# EAGLE design relayboard (EAGLE 8.1.1)
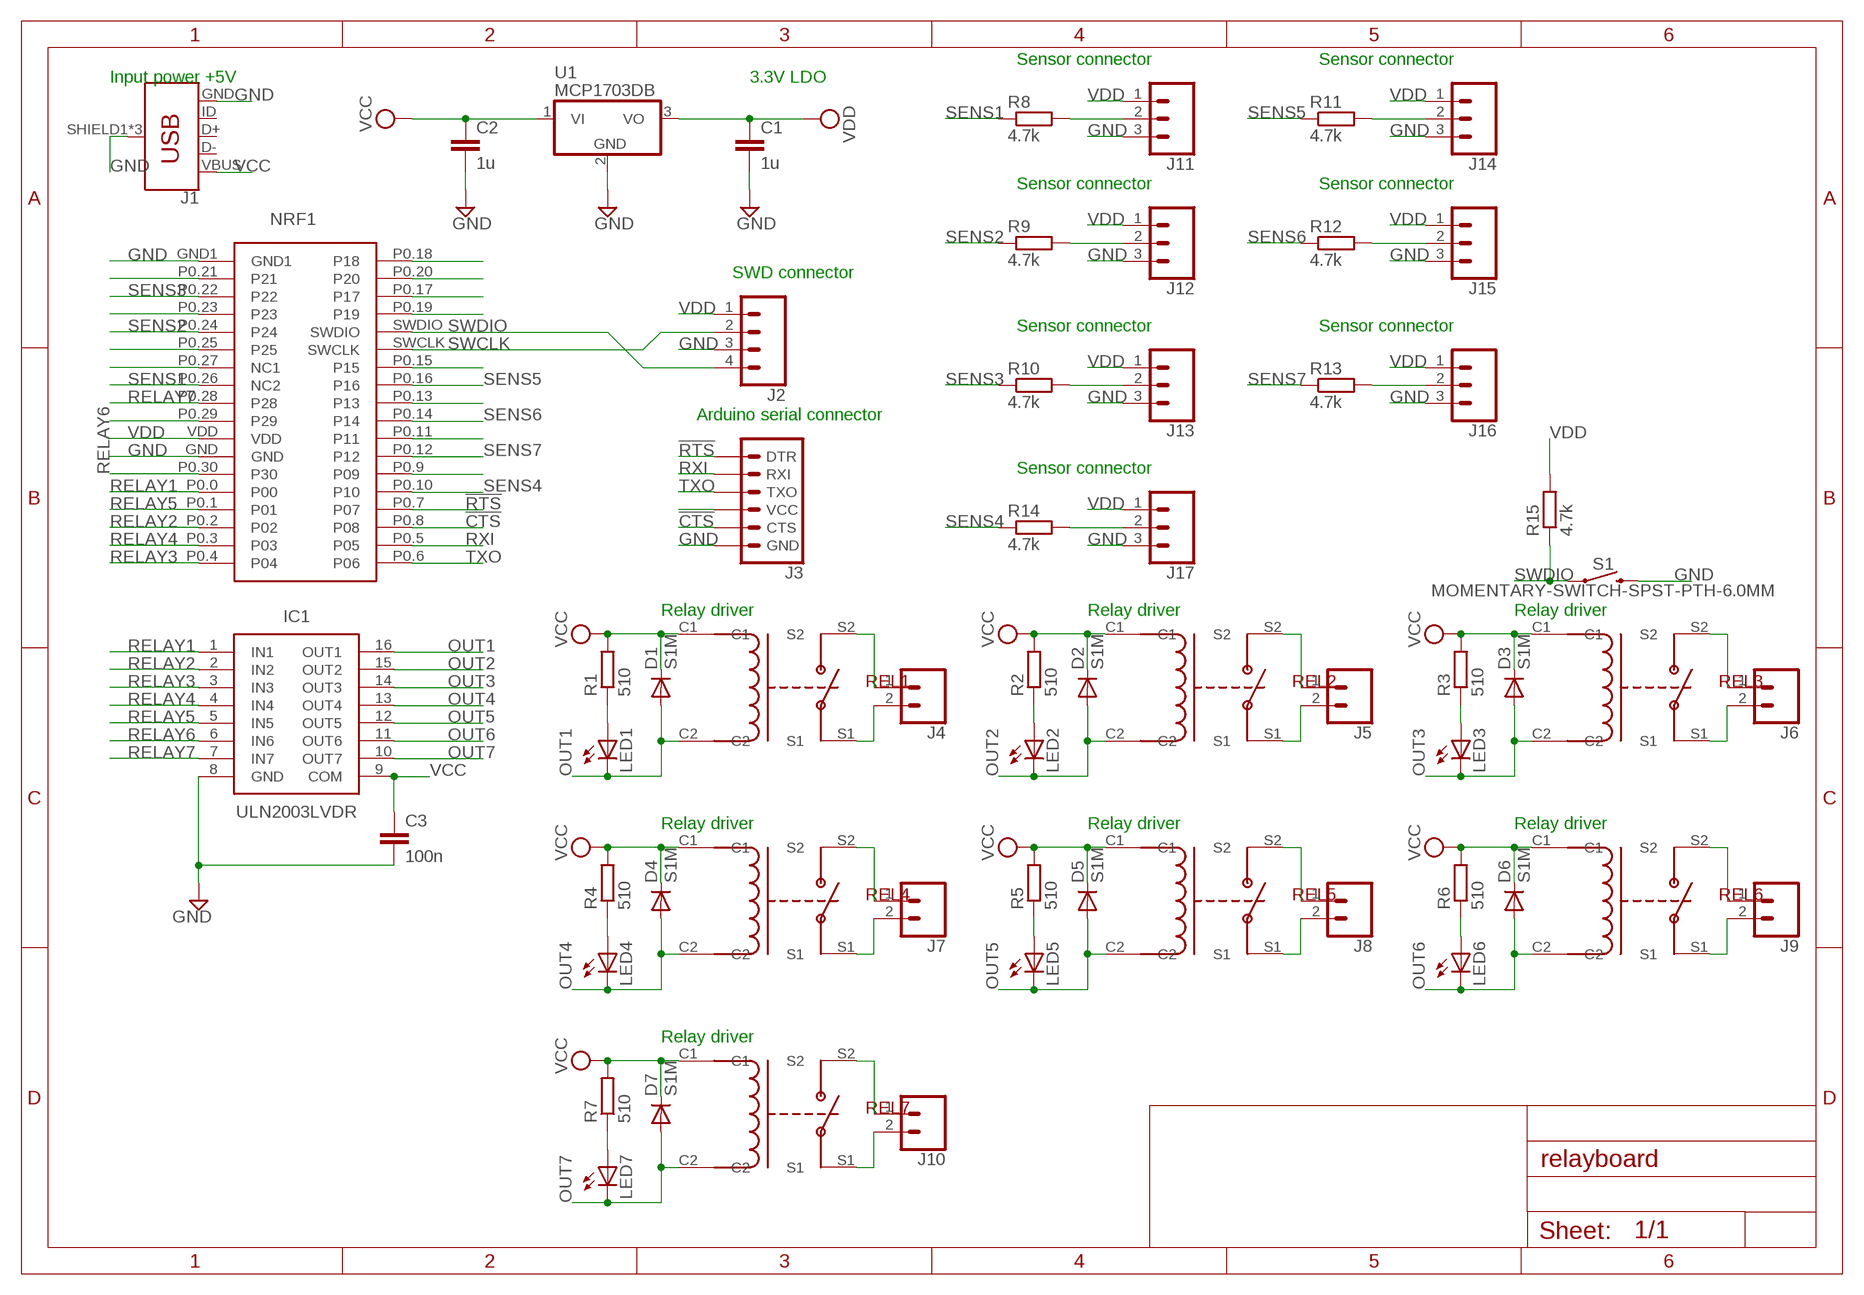
[diagram p0: schematic, sheet 1]

## Parts
C1  1u  C-EUC0805  [C0805]
C2  1u  C-EUC0805  [C0805]
C3  100n  C-EUC0805  [C0805]
D1  S1M  [SMA]
D2  S1M  [SMA]
D3  S1M  [SMA]
D4  S1M  [SMA]
D5  S1M  [SMA]
D6  S1M  [SMA]
D7  S1M  [SMA]
IC1  ULN2003LVDR  [SOIC127P600X175-16N]
J1  USB_MICRO-B_FEMALE-SMT  [USB-B-MICRO-SMD]
J2  CONN_04  [1X04]
J3  6_PIN_SERIAL_TARGET  [1X06]
J4  CONN_025MM  [SCREWTERMINAL-5MM-2]
J5  CONN_025MM  [SCREWTERMINAL-5MM-2]
J6  CONN_025MM  [SCREWTERMINAL-5MM-2]
J7  CONN_025MM  [SCREWTERMINAL-5MM-2]
J8  CONN_025MM  [SCREWTERMINAL-5MM-2]
J9  CONN_025MM  [SCREWTERMINAL-5MM-2]
J10  CONN_025MM  [SCREWTERMINAL-5MM-2]
J11  CONN_03SCREW  [SCREWTERMINAL-3.5MM-3]
J12  CONN_03SCREW  [SCREWTERMINAL-3.5MM-3]
J13  CONN_03SCREW  [SCREWTERMINAL-3.5MM-3]
J14  CONN_03SCREW  [SCREWTERMINAL-3.5MM-3]
J15  CONN_03SCREW  [SCREWTERMINAL-3.5MM-3]
J16  CONN_03SCREW  [SCREWTERMINAL-3.5MM-3]
J17  CONN_03SCREW  [SCREWTERMINAL-3.5MM-3]
LED1  LEDSML1206  [SML1206]
LED2  LEDSML1206  [SML1206]
LED3  LEDSML1206  [SML1206]
LED4  LEDSML1206  [SML1206]
LED5  LEDSML1206  [SML1206]
LED6  LEDSML1206  [SML1206]
LED7  LEDSML1206  [SML1206]
NRF1  NRF51822MODULE  [NRF]
R1  510  R-EU_R0603  [R0603]
R2  510  R-EU_R0603  [R0603]
R3  510  R-EU_R0603  [R0603]
R4  510  R-EU_R0603  [R0603]
R5  510  R-EU_R0603  [R0603]
R6  510  R-EU_R0603  [R0603]
R7  510  R-EU_R0603  [R0603]
R8  4.7k  R-EU_R0603  [R0603]
R9  4.7k  R-EU_R0603  [R0603]
R10  4.7k  R-EU_R0603  [R0603]
R11  4.7k  R-EU_R0603  [R0603]
R12  4.7k  R-EU_R0603  [R0603]
R13  4.7k  R-EU_R0603  [R0603]
R14  4.7k  R-EU_R0603  [R0603]
R15  4.7k  R-EU_R0603  [R0603]
REL1  NY5WK  [NY5WK]
REL2  NY5WK  [NY5WK]
REL3  NY5WK  [NY5WK]
REL4  NY5WK  [NY5WK]
REL5  NY5WK  [NY5WK]
REL6  NY5WK  [NY5WK]
REL7  NY5WK  [NY5WK]
S1  MOMENTARY-SWITCH-SPST-PTH-6.0MM  [TACTILE_SWITCH_PTH_6.0MM]
U1  MCP1703DB  [SOT223]

## Nets
!CTS: J3.5(CTS) NRF1.P0.8(P08)
!RTS: J3.1(DTR) NRF1.P0.7(P07)
GND [dc_power]: C1.2 C2.2 C3.2 IC1.8(GND) J1.GND J1.SHIELD1(SHIELD) J1.SHIELD2(SHIELD) J1.SHIELD3(SHIELD) J2.3 J3.6(GND) J11.3 J12.3 J13.3 J14.3 J15.3 J16.3 J17.3 NRF1.GND NRF1.GND1 S1.3 U1.2(GND)
N$1: LED1.A R1.1
N$2 [ac_power]: J4.1 REL1.S2
N$3: NRF1.P0.21(P21)
N$4: NRF1.P0.9(P09)
N$5: NRF1.P0.23(P23)
N$6: NRF1.P0.18(P18)
N$7: NRF1.P0.25(P25)
N$8: NRF1.P0.27(NC1)
N$9: NRF1.P0.20(P20)
N$10: NRF1.P0.17(P17)
N$11: NRF1.P0.29(P29)
N$12: NRF1.P0.19(P19)
N$13: NRF1.P0.11(P11)
N$14: NRF1.P0.13(P13)
N$18: J12.2 R9.2
N$29: NRF1.P0.15(P15)
N$30 [ac_power]: J4.2 REL1.S1
N$31: LED2.A R2.1
N$36: J3.4(VCC)
N$37 [ac_power]: J5.1 REL2.S2
N$38 [ac_power]: J5.2 REL2.S1
N$39: LED3.A R3.1
N$40 [ac_power]: J6.1 REL3.S2
N$41 [ac_power]: J6.2 REL3.S1
N$42: LED4.A R4.1
N$43 [ac_power]: J7.1 REL4.S2
N$44 [ac_power]: J7.2 REL4.S1
N$45: LED5.A R5.1
N$46 [ac_power]: J8.1 REL5.S2
N$47 [ac_power]: J8.2 REL5.S1
N$48: LED6.A R6.1
N$49 [ac_power]: J9.1 REL6.S2
N$50 [ac_power]: J9.2 REL6.S1
N$51: LED7.A R7.1
N$52 [ac_power]: J10.1 REL7.S2
N$53 [ac_power]: J10.2 REL7.S1
N$54: J11.2 R8.2
N$55: J13.2 R10.2
N$56: J14.2 R11.2
N$57: J15.2 R12.2
N$58: J16.2 R13.2
N$59: J17.2 R14.2
OUT1 [dc_power]: D1.A IC1.16(OUT1) LED1.C REL1.C2
OUT2 [dc_power]: D2.A IC1.15(OUT2) LED2.C REL2.C2
OUT3 [dc_power]: D3.A IC1.14(OUT3) LED3.C REL3.C2
OUT4 [dc_power]: D4.A IC1.13(OUT4) LED4.C REL4.C2
OUT5 [dc_power]: D5.A IC1.12(OUT5) LED5.C REL5.C2
OUT6 [dc_power]: D6.A IC1.11(OUT6) LED6.C REL6.C2
OUT7 [dc_power]: D7.A IC1.10(OUT7) LED7.C REL7.C2
RELAY1: IC1.1(IN1) NRF1.P0.0(P00)
RELAY2: IC1.2(IN2) NRF1.P0.2(P02)
RELAY3: IC1.3(IN3) NRF1.P0.4(P04)
RELAY4: IC1.4(IN4) NRF1.P0.3(P03)
RELAY5: IC1.5(IN5) NRF1.P0.1(P01)
RELAY6: IC1.6(IN6) NRF1.P0.30(P30)
RELAY7: IC1.7(IN7) NRF1.P0.28(P28)
RXI: J3.2(RXI) NRF1.P0.5(P05)
SENS1: NRF1.P0.26(NC2) R8.1
SENS2: NRF1.P0.24(P24) R9.1
SENS3: NRF1.P0.22(P22) R10.1
SENS4: NRF1.P0.10(P10) R14.1
SENS5: NRF1.P0.16(P16) R11.1
SENS6: NRF1.P0.14(P14) R12.1
SENS7: NRF1.P0.12(P12) R13.1
SWCLK: J2.2 NRF1.SWCLK
SWDIO: J2.4 NRF1.SWDIO R15.1 S1.1
TXO: J3.3(TXO) NRF1.P0.6(P06)
VCC [dc_power]: C2.1 C3.1 D1.C D2.C D3.C D4.C D5.C D6.C D7.C IC1.9(COM) J1.VBUS R1.2 R2.2 R3.2 R4.2 R5.2 R6.2 R7.2 REL1.C1 REL2.C1 REL3.C1 REL4.C1 REL5.C1 REL6.C1 REL7.C1 U1.1(VI)
VDD: C1.1 J2.1 J11.1 J12.1 J13.1 J14.1 J15.1 J16.1 J17.1 NRF1.VDD R15.2 U1.3(VO)
Unconnected: J1.D+ J1.D- J1.ID

## Notes on the sheet
- Sensor connector | Sensor connector
- Input power +5V | 3.3V LDO
- Sensor connector | Sensor connector
- SWD connector
- Sensor connector | Sensor connector
- Arduino serial connector
- Sensor connector
- Relay driver | Relay driver | Relay driver
- Relay driver | Relay driver | Relay driver
- Relay driver

## Library data of the parts
C1-C3 = rcl:C-EU: CAPACITOR, European symbol
D1-D7 = diode:S1M
IC1 = ULN2003LVDR:ULN2003LVDR: 7-Ch Relay, Inductive Sink Driver SOIC16 Texas Instruments ULN2003LVDR, 7-element NPN Darlington Transistor Array, 140 mA 8 V, 16-Pin SOIC <https://componentsearchengine.com/Images/3/ULN2003LVDR.jpg> Source: Datasheet <http://www.ti.com/lit/ds/symlink/uln2003lv.pdf>; DESCRIPTION: 7-Ch Relay, Inductive Sink Driver SOIC16 Texas Instruments ULN2003LVDR, 7-element NPN Darlington Transistor Array, 140 mA 8 V, 16-Pin SOIC; HEIGHT: 1.75mm; MANUFACTURER_NAME: Texas Instruments; MANUFACTURER_PART_NUMBER: ULN2003LVDR; RS_PART_NUMBER: 8095475; SUPPLIER_NAME: RS
J1 = newrelay:USB_MICRO-B: USB Type Micro-B Connector Male/female and PTH/SMT variants SparkFun Products: SparkFun microB USB Breakout <https://www.sparkfun.com/products/12035> SparkFun USB microB Plug Breakout <https://www.sparkfun.com/products/10031> SparkFun ESP8266 Thing <https://www.sparkfun.com/products/13231>; PROD_ID: CONN-11752
J2 = SparkFun-Connectors:CONN_04: Multi connection point. Often used as Generic Header-pin footprint for 0.1 inch spaced/style header connections On any of the 0.1 inch spaced packages, you can populate with these: Break Away Headers - Straight <https://www.sparkfun.com/products/116> (PRT-00116) Break Away Male Headers - Right Angle <https://www.sparkfun.com/products/553> (PRT-00553) Female Headers <https://www.sparkfun.com/products/115> (PRT-00115) Break Away Headers - Machine Pin <https://www.sparkfun.com/products/117> (PRT-00117) Break Away Female Headers - Swiss Machine Pin <https://www.sparkfun.com/products/743> (PRT-00743) For SCREWTERMINALS and SPRING TERMINALS visit here: Screw Terimnals on SparkFun.com <https://www.sparkfun.com/search/results?term=Screw+Terminals> (5mm/3.5mm/2.54mm spacing) This device is also useful as a general connection point to wire up your design to another part of your project. Our various solder wires solder well into these plated through hole pads. Hook-Up Wire - Assortment (Stranded, 22 AWG) <https://www.sparkfun.com/products/11375> (PRT-11375) Hook-Up Wire - Assortment (Solid Core, 22 AWG) <https://www.sparkfun.com/products/11367> (PRT-11367) View the entire wire category on our website here <https://www.sparkfun.com/categories/141> Special notes: Molex polarized connector foot print use with SKU : PRT-08231 with associated crimp pins and housings. 1MM SMD Version SKU: PRT-10208; PROD_ID: CONN-09696
J3 = SparkFun-Connectors:6_PIN_SERIAL_TARGET: 6-pin header connection for use with the "FTDI BASIC" pinout - TARGET SIDE. Also known as "Arduino Serial Program Header". It is used to mate with our FTDI Basic serial programmers using the Arduino IDE. Note, this device has "TARGET" in the name. It is intended to be used on a design that contains a target micro-controller that you wish to program. The "sister" device, named "CABLE" is inteneded to be used on a design that usually lives on the end of your USB cable and prvides the converter chip (FTDI232 or FTDI231x) to commnicate serial RX/TX. You can populate with some of these: Break Away Headers - Straight <https://www.sparkfun.com/products/116> (PRT-00116) For reference (or to suit your programming needs) check out these designs: SparkFun FTDI Basic Breakout - 5V <https://www.sparkfun.com/products/9716> (DEV-09716) SparkFun FTDI Basic Breakout - 3.3V <https://www.sparkfun.com/products/9873> (DEV-09873) SparkFun FTDI SmartBasic <https://www.sparkfun.com/products/12935> (DEV-12935) SparkFun Beefy 3 - FTDI Basic Breakout <https://www.sparkfun.com/products/13746> (DEV-13746)
J4-J10 = SparkFun-Connectors:CONN_02: Multi connection point. Often used as Generic Header-pin footprint for 0.1 inch spaced/style header connections On any of the 0.1 inch spaced packages, you can populate with these: Break Away Headers - Straight <https://www.sparkfun.com/products/116> (PRT-00116) Break Away Male Headers - Right Angle <https://www.sparkfun.com/products/553> (PRT-00553) Female Headers <https://www.sparkfun.com/products/115> (PRT-00115) Break Away Headers - Machine Pin <https://www.sparkfun.com/products/117> (PRT-00117) Break Away Female Headers - Swiss Machine Pin <https://www.sparkfun.com/products/743> (PRT-00743) For SCREWTERMINALS and SPRING TERMINALS visit here: Screw Terimnals on SparkFun.com <https://www.sparkfun.com/search/results?term=Screw+Terminals> (5mm/3.5mm/2.54mm spacing) This device is also useful as a general connection point to wire up your design to another part of your project. Our various solder wires solder well into these plated through hole pads. Hook-Up Wire - Assortment (Stranded, 22 AWG) <https://www.sparkfun.com/products/11375> (PRT-11375) Hook-Up Wire - Assortment (Solid Core, 22 AWG) <https://www.sparkfun.com/products/11367> (PRT-11367) View the entire wire category on our website here <https://www.sparkfun.com/categories/141> Special notes: Molex polarized connector foot print use with: PRT-08233 with associated crimp pins and housings. 2.54_SCREWTERM for use with PRT-10571. 3.5mm Screw Terminal footprints for PRT-08084 5mm Screw Terminal footprints for use with PRT-08432; SF_SKU: PRT-08432
J11-J17 = SparkFun-Connectors:CONN_03: Multi connection point. Often used as Generic Header-pin footprint for 0.1 inch spaced/style header connections On any of the 0.1 inch spaced packages, you can populate with these: Break Away Headers - Straight <https://www.sparkfun.com/products/116> (PRT-00116) Break Away Male Headers - Right Angle <https://www.sparkfun.com/products/553> (PRT-00553) Female Headers <https://www.sparkfun.com/products/115> (PRT-00115) Break Away Headers - Machine Pin <https://www.sparkfun.com/products/117> (PRT-00117) Break Away Female Headers - Swiss Machine Pin <https://www.sparkfun.com/products/743> (PRT-00743) Stackable Header - 3 Pin (Female, 0.1") <https://www.sparkfun.com/products/13875> (PRT-13875) For SCREWTERMINALS and SPRING TERMINALS visit here: Screw Terimnals on SparkFun.com <https://www.sparkfun.com/search/results?term=Screw+Terminals> (5mm/3.5mm/2.54mm spacing) This device is also useful as a general connection point to wire up your design to another part of your project. Our various solder wires solder well into these plated through hole pads. Hook-Up Wire - Assortment (Stranded, 22 AWG) <https://www.sparkfun.com/products/11375> (PRT-11375) Hook-Up Wire - Assortment (Solid Core, 22 AWG) <https://www.sparkfun.com/products/11367> (PRT-11367) View the entire wire category on our website here <https://www.sparkfun.com/categories/141> Special notes: Molex polarized connector foot print use with SKU : PRT-08232 with associated crimp pins and housings.; PROD_ID: CONN-08288; SF_ID: PRT-08235
LED1-LED7 = led:LED: LED OSRAM: - CHIPLED LG R971, LG N971, LY N971, LG Q971, LY Q971, LO R971, LY R971 LH N974, LH R974 LS Q976, LO Q976, LY Q976 LO Q996 - Hyper CHIPLED LW Q18S LB Q993, LB Q99A, LB R99A - SideLED LS A670, LO A670, LY A670, LG A670, LP A670 LB A673, LV A673, LT A673, LW A673 LH A674 LY A675 LS A676, LA A676, LO A676, LY A676, LW A676 LS A679, LY A679, LG A679 - Hyper Micro SIDELED® LS Y876, LA Y876, LO Y876, LY Y876 LT Y87S - SmartLED LW L88C, LW L88S LB L89C, LB L89S, LG L890 LS L89K, LO L89K, LY L89K LS L896, LA L896, LO L896, LY L896 - TOPLED LS T670, LO T670, LY T670, LG T670, LP T670 LSG T670, LSP T670, LSY T670, LOP T670, LYG T670 LG T671, LOG T671, LSG T671 LB T673, LV T673, LT T673, LW T673 LH T674 LS T676, LA T676, LO T676, LY T676, LB T676, LH T676, LSB T676, LW T676 LB T67C, LV T67C, LT T67C, LS T67K, LO T67K, LY T67K, LW E67C LS E67B, LA E67B, LO E67B, LY E67B, LB E67C, LV E67C, LT E67C LW T67C LS T679, LY T679, LG T679 LS T770, LO T770, LY T770, LG T770, LP T770 LB T773, LV T773, LT T773, LW T773 LH T774 LS E675, LA E675, LY E675, LS T675 LS T776, LA T776, LO T776, LY T776, LB T776 LHGB T686 LT T68C, LB T68C - Hyper Mini TOPLED® LB M676 - Mini TOPLED Santana® LG M470 LS M47K, LO M47K, LY M47K Source: http://www.osram.convergy.de LUXEON: - LUMILED® LXK2-PW12-R00, LXK2-PW12-S00, LXK2-PW14-U00, LXK2-PW14-V00 LXK2-PM12-R00, LXK2-PM12-S00, LXK2-PM14-U00 LXK2-PE12-Q00, LXK2-PE12-R00, LXK2-PE12-S00, LXK2-PE14-T00, LXK2-PE14-U00 LXK2-PB12-K00, LXK2-PB12-L00, LXK2-PB12-M00, LXK2-PB14-N00, LXK2-PB14-P00, LXK2-PB14-Q00 LXK2-PR12-L00, LXK2-PR12-M00, LXK2-PR14-Q00, LXK2-PR14-R00 LXK2-PD12-Q00, LXK2-PD12-R00, LXK2-PD12-S00 LXK2-PH12-R00, LXK2-PH12-S00 LXK2-PL12-P00, LXK2-PL12-Q00, LXK2-PL12-R00 Source: www.luxeon.com KINGBRIGHT: KA-3528ASYC Source: www.kingbright.com
NRF1 = nrf:NRF51822MODULE
R1-R15 = rcl:R-EU_: RESISTOR, European symbol
REL1-REL7 = ny5wk:NY5WK
S1 = SparkFun-Switches:MOMENTARY-SWITCH-SPST: Momentary Switch (Pushbutton) - SPST Normally-open (NO) SPST momentary switches (buttons, pushbuttons). Variants PTH-12MM - 12mm square, through-hole Momentary Pushbutton Switch - 12mm Square <https://www.sparkfun.com/products/9190> (COM-09190) PTH-6.0MM, PTH-6.0MM-KIT - 6.0mm square, through-hole Mini Pushbutton Switch <https://www.sparkfun.com/products/97> (COM-00097) KIT package intended for soldering kit's - only one side of pads' copper is exposed. PTH-RIGHT-ANGLE-KIT - Right-angle, through-hole Right Angle Tactile Button <https://www.sparkfun.com/products/10791> - Used on SparkFun BigTime Watch Kit <https://www.sparkfun.com/products/11734> SMD-12MM - 12mm square, surface-mount Tactile Button - SMD (12mm) <https://www.sparkfun.com/products/12993> (COM-12993) Used on SparkFun PicoBoard <https://www.sparkfun.com/products/11888> SMD-4.5MM - 4.5mm Square Trackball Switch Used on SparkFun Blackberry Trackballer Breakout <https://www.sparkfun.com/products/13169> SMD-4.6MMX2.8MM - 4.60mm x 2.80mm, surface mount Used on SparkFun SAMD21 Mini Breakout <https://www.sparkfun.com/products/13664> SMD-5.2MM, SMD-5.2-REDUNDANT - 5.2mm square, surface-mount Mini Pushbutton Switch - SMD <https://www.sparkfun.com/products/8720> (COM-08720) Used on Arduino Pro Mini <https://www.sparkfun.com/products/11114> REDUNDANT package connects both switch circuits together SMD-6.0X3.5MM - 6.0 x 3.5mm, surface mount Momentary Reset Switch SMD <https://www.sparkfun.com/products/8229> (COM-08229) SMD-6.2MM-TALL - 6.2mm square, surface mount Tactile Button - SMD (6mm) <https://www.sparkfun.com/products/12992> Used on SparkFun Digital Sandbox <https://www.sparkfun.com/products/12651> SMD-RIGHT-ANGLE - Right-angle, surface mount Used on SparkFun Block for Intel® Edison - Arduino <https://www.sparkfun.com/products/13036>; PROD_ID: SWCH-08441; SF_SKU: COM-00097
U1 = linear:MCP1703: 250 mA, 16V, Low Quiescent Current LDO Regulator Source: http://ww1.microchip.com/downloads/en/DeviceDoc/22049b.pdf

## Net classes
0 net: width 0.254 mm, drill 0.254 mm, clearance 0.254 mm
1 dc_power: width 0.508 mm, drill 0.508 mm, clearance 0.254 mm
2 ac_power: width 1.016 mm, drill 1.016 mm, clearance 0.508 mm

## Board
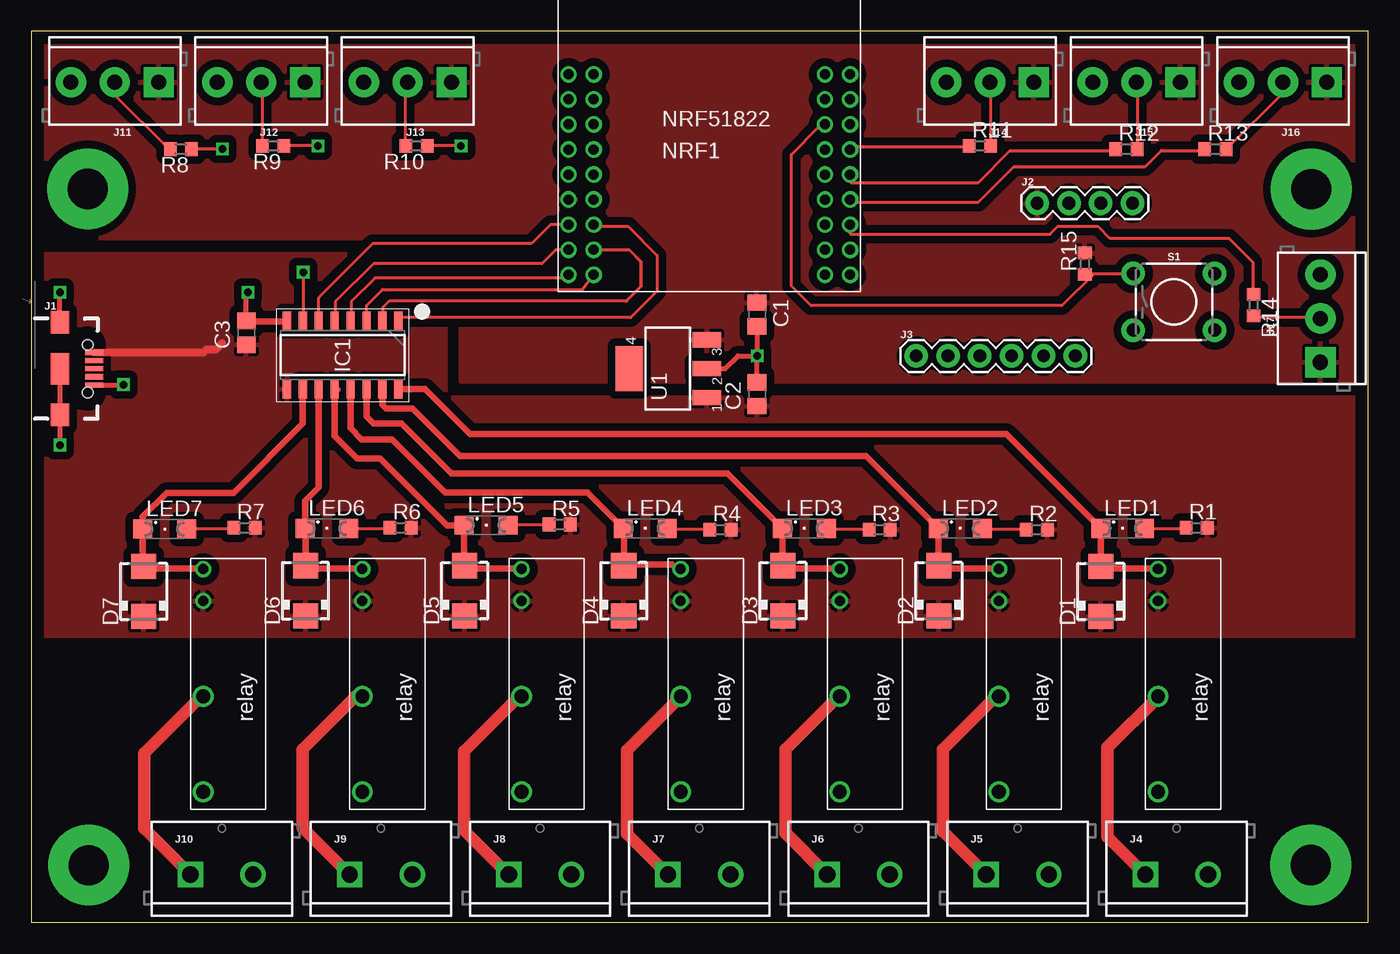
[diagram p1: board, top side]
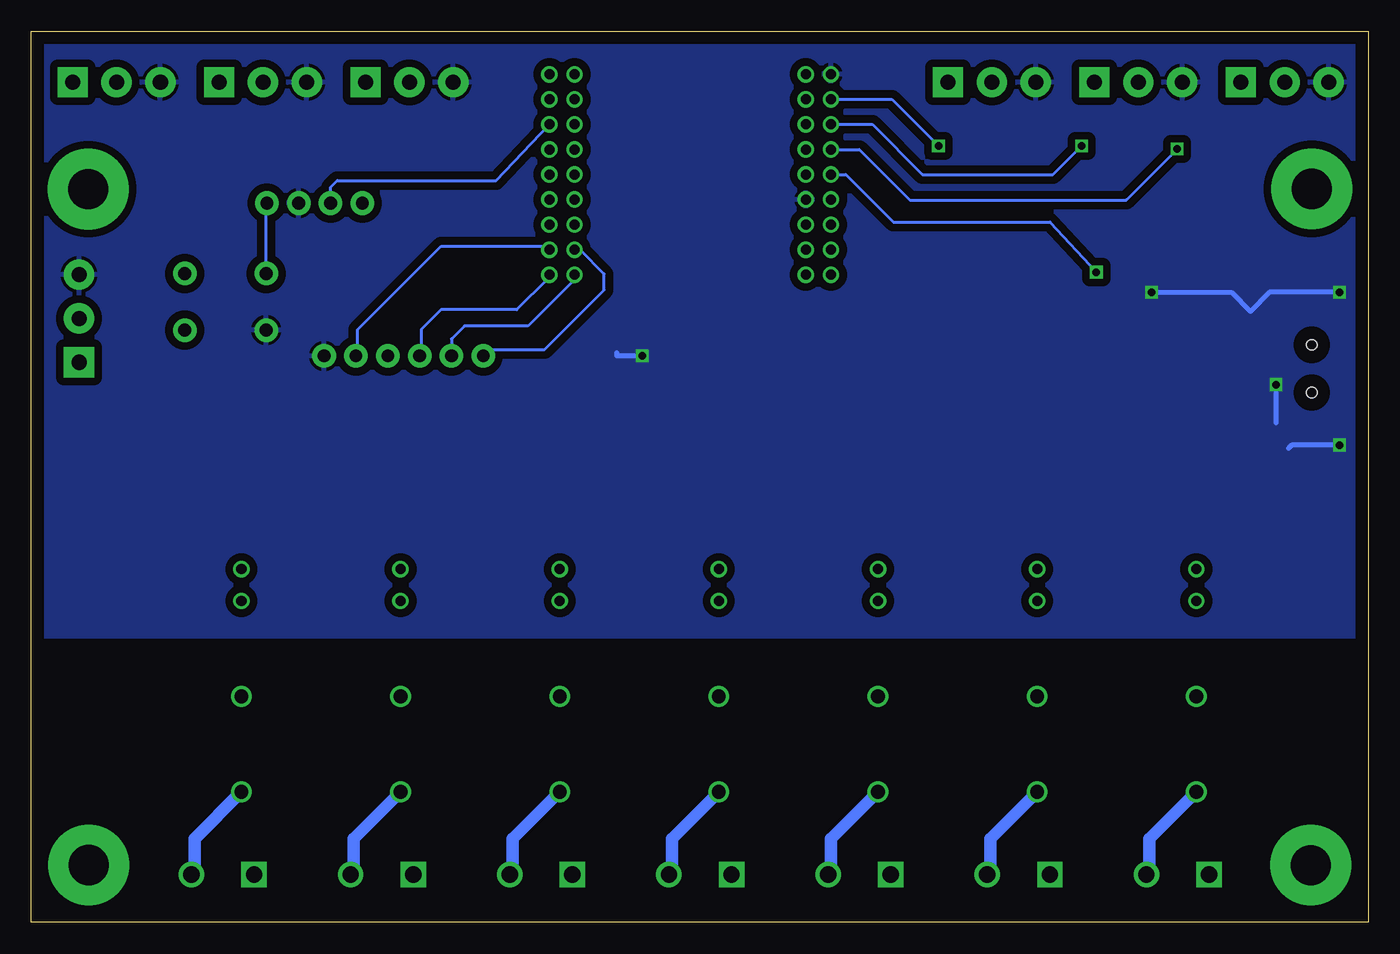
[diagram p2: board, bottom side, seen from below]

Size 106.68 x 71.12 mm. Coordinates in mm from the lower left corner, seen from the top.
Outline: 0,0 106.68,0 106.68,71.12 0,71.12 0,0
Copper layers (1*16): Top 0.035mm / dielectric 1.5mm / Bottom 0.035mm
Design rules "default *": minimum track width 10mil, minimum drill 24mil, track to track 16mil, track to pad 16mil, pad to pad 16mil, via to via 16mil, smd to smd 10mil, copper to edge 40mil, drill to drill 10mil, minimum pad ring 10mil, minimum via ring 8mil, stop-mask expansion 4mil, vias tented up to drill 0mil, thermal gap 10mil

### Footprints (pad centres in the part's own frame; a part is rotated, then mirrored left to right if it is on the bottom)
C0805 = smd 1.3 x 1.5: 1 -0.95,0; 2 0.95,0
SMA = smd 2 x 2: A 2,0; C -2,0
SOIC127P600X175-16N = smd 1.525 x 0.65: 1 -2.712,4.445; 2 -2.712,3.175; 3 -2.712,1.905; 4 -2.712,0.635; 5 -2.712,-0.635; 6 -2.712,-1.905; 7 -2.712,-3.175; 8 -2.712,-4.445; 9 2.712,-4.445; 10 2.712,-3.175; 11 2.712,-1.905; 12 2.712,-0.635; 13 2.712,0.635; 14 2.712,1.905; 15 2.712,3.175; 16 2.712,4.445
USB-B-MICRO-SMD = smd 1.45 x 0.4: D+ 2.725,0; D- 2.725,0.65; GND 2.725,-1.3; ID 2.725,-0.65; VBUS 2.725,1.3 | smd 1.5 x 1.8: SHIELD1 0,3.685; SHIELD2 0,-3.685 | smd 1.5 x 2.5: SHIELD3 0,0 | hole 0.85: 2.2,1.9; 2.2,-1.9
1X04 = drill 1.016 pad 1.88: 1 0,0; 2 2.54,0; 3 5.08,0; 4 7.62,0
1X06 = drill 1.016 pad 1.88: 1 0,0; 2 2.54,0; 3 5.08,0; 4 7.62,0; 5 10.16,0; 6 12.7,0
SCREWTERMINAL-5MM-2 = drill 1.3 pad 2.032 square: 1 0,0 | drill 1.3 pad 2.032: 2 5,0
SCREWTERMINAL-3.5MM-3 = drill 1.2 pad 2.413 square: 1 0,0 | drill 1.2 pad 2.413: 2 3.5,0; 3 7,0
SML1206 = smd 1.5 x 1.5: A 1.75,0; C -1.75,0
NRF = drill 0.8: GND -11.23,8; GND1 -9.23,-2; P0.0 -9.23,-4; P0.1 -11.23,-6; P0.2 -9.23,-6; P0.3 -11.23,-8; P0.4 -9.23,-8; P0.5 9.23,-8; P0.6 11.23,-8; P0.7 9.23,-6; P0.8 11.23,-6; P0.9 9.23,-4; P0.10 11.23,-4; P0.11 9.23,-2; P0.12 11.23,-2; P0.13 9.23,0; P0.14 11.23,0; P0.15 9.23,2; P0.16 11.23,2; P0.17 9.23,6; P0.18 9.23,8; P0.19 11.23,6; P0.20 11.23,8; P0.21 -9.23,8; P0.22 -11.23,6; P0.23 -9.23,6; P0.24 -11.23,4; P0.25 -9.23,4; P0.26 -11.23,2; P0.27 -9.23,2; P0.28 -11.23,0; P0.29 -9.23,0; P0.30 -11.23,-4; SWCLK 11.23,4; SWDIO 9.23,4; VDD -11.23,-2
R0603 = smd 1 x 1.1: 1 -0.85,0; 2 0.85,0
NY5WK = drill 0.8: C1 7.62,0; C2 10.16,0 | drill 1.1: S1 -7.62,0; S2 0,0
TACTILE_SWITCH_PTH_6.0MM = drill 1.016 pad 1.88: 1 -3.251,2.261; 2 3.251,2.261; 3 -3.251,-2.261; 4 3.251,-2.261
SOT223 = smd 1.219 x 2.235: 1 -2.311,-3.099; 2 0,-3.099; 3 2.311,-3.099 | smd 3.6 x 2.2: 4 0,3.099

### Placement (x,y rotation side)
C1  57.91,48.51 270 top
C2  57.91,42.16 90 top
C3  17.16,47.05 90 top
D1  85.34,26.42 90 top
D2  72.42,26.47 90 top
D3  59.98,26.47 90 top
D4  47.28,26.47 90 top
D5  34.58,26.47 90 top
D6  21.88,26.47 90 top
D7  8.96,26.42 90 top
IC1  24.84,45.27 270 top
J1  2.29,44.2 0 top
J2  80.26,57.4 0 top
J3  70.61,45.21 0 top
J4  88.9,3.81 0 top
J5  76.2,3.81 0 top
J6  63.5,3.81 0 top
J7  50.8,3.81 0 top
J8  38.1,3.81 0 top
J9  25.4,3.81 0 top
J10  12.7,3.81 0 top
J11  10.16,67.06 180 top
J12  21.84,67.06 180 top
J13  33.53,67.06 180 top
J14  80.01,67.06 180 top
J15  91.69,67.06 180 top
J16  103.38,67.06 180 top
J17  102.87,44.7 90 top
LED1  87.09,31.44 0 top
LED2  74.14,31.44 0 top
LED3  61.69,31.44 0 top
LED4  48.99,31.44 0 top
LED5  36.29,31.7 0 top
LED6  23.59,31.44 0 top
LED7  10.65,31.4 0 top
NRF1  54.1,59.69 0 top
R1  92.99,31.5 0 top
R2  80.24,31.34 0 top
R3  67.69,31.34 0 top
R4  54.99,31.34 0 top
R5  42.16,31.75 0 top
R6  29.46,31.5 0 top
R7  17.02,31.5 0 top
R8  11.94,61.72 180 top
R9  19.3,61.98 180 top
R10  30.73,61.98 180 top
R11  75.69,61.98 0 top
R12  87.38,61.72 0 top
R13  94.49,61.72 0 top
R14  97.54,49.28 270 top
R15  84.07,52.58 90 top
REL1  89.92,18.03 90 top
REL2  77.22,18.03 90 top
REL3  64.52,18.03 90 top
REL4  51.82,18.03 90 top
REL5  39.12,18.03 90 top
REL6  26.42,18.03 90 top
REL7  13.72,18.03 90 top
S1  91.19,49.53 0 top
U1  50.8,44.2 90 top

### Tracks (layer width: path | path; a pad name or v marks a point on that pad's centre or on a via)
!CTS
  Bottom 0.254: NRF1.P0.8 65.41,53.98 73.98,53.98 80.64,47.31 80.64,45.4 J3.5
!RTS
  Bottom 0.254: NRF1.P0.7 62.87,53.66 60.96,51.75 60.96,50.48 65.72,45.72 70.48,45.72 70.48,45.4 J3.1
GND  (via drill 0.6)
  Top 0.406: C2.2 v57.91,45.21 | C1.2 v57.91,45.21 | U1.2 55.37,44.2 56.39,45.21 v57.91,45.21 | J1.SHIELD1 v2.29,50.29 | v2.29,38.1 J1.SHIELD2 J1.SHIELD3 | J1.GND 7.34,42.9 v7.37,42.93 | C3.2 17.16,50.18 v17.27,50.29
  Top 0.508: IC1.8 20.32,47.94 17.46,47.94 C3.2
  Bottom 0.406: v57.91,45.21 59.94,45.21 59.94,45.47 | v2.29,50.29 7.87,50.29 9.4,48.77 10.92,50.29 v17.27,50.29 | v2.29,38.1 6.1,38.1 6.35,37.85 | v7.37,42.93 7.37,39.88
  pour Bottom (isolate 0.61): 0,71.12 106.68,71.12 106.68,22.86 0,22.86
N$1
  Top 0.254: R1.1 92.08,31.43 88.9,31.43 LED1.A
N$2
  Top 1.016: REL1.S2 89.92,18.01 85.88,13.97 85.88,6.83 J4.1
N$15  (via drill 3.2 pad 6.45)
  other vias: 4.5,58.55
N$16  (via drill 3.2 pad 6.45)
  other vias: 4.59,4.57
N$17  (via drill 3.2 pad 6.45)
  other vias: 102.11,4.58
N$18
  Top 0.254: R9.2 18.41,62.23 18.41,66.99 J12.2
N$19  (via drill 3.2 pad 6.45)
  other vias: 102.14,58.52
N$30
  Bottom 1.016: REL1.S1 93.66,6.67 93.66,3.81 J4.2
N$31
  Top 0.254: R2.1 75.99,31.34 LED2.A
N$37
  Top 1.016: REL2.S2 76.99,18.03 72.75,13.79 72.75,7.26 J5.1
N$38
  Bottom 1.016: REL2.S1 80.96,6.67 80.96,3.81 J5.2
N$39
  Top 0.254: R3.1 63.54,31.34 LED3.A
N$40
  Top 1.016: REL3.S2 64.41,18.03 60.17,13.79 60.17,7.14 J6.1
N$41
  Bottom 1.016: REL3.S1 68.26,6.67 68.26,3.81 J6.2
N$42
  Top 0.254: R4.1 50.84,31.34 LED4.A
N$43
  Top 1.016: REL4.S2 51.82,18.01 47.52,13.72 47.52,7.09 J7.1
N$44
  Bottom 1.016: REL4.S1 55.56,6.67 55.56,3.81 J7.2
N$45
  Top 0.254: R5.1 38.1,31.75 LED5.A
N$46
  Top 1.016: REL5.S2 38.94,18.03 34.54,13.64 34.54,7.37 J8.1
N$47
  Bottom 1.016: REL5.S1 42.86,6.67 42.86,3.81 J8.2
N$48
  Top 0.254: R6.1 28.57,31.43 25.4,31.43 LED6.A
N$49
  Top 1.016: REL6.S2 25.88,18.03 21.64,13.79 21.64,7.57 J9.1
N$50
  Bottom 1.016: REL6.S1 30.16,6.67 30.16,3.81 J9.2
N$51
  Top 0.254: R7.1 15.88,31.43 12.7,31.43 LED7.A
N$52
  Top 1.016: REL7.S2 13.54,18.03 8.99,13.49 8.99,7.52 J10.1
N$53
  Bottom 1.016: REL7.S1 17.46,6.67 17.46,3.81 J10.2
N$54
  Top 0.254: R8.2 10.79,61.91 6.67,66.04 6.67,66.99 J11.2
N$55
  Top 0.254: R10.2 29.84,62.23 29.84,66.99 J13.2
N$56
  Top 0.254: R11.2 76.52,62.23 76.52,66.99 J14.2
N$57
  Top 0.254: R12.2 88.27,61.91 88.27,66.99 J15.2
N$58
  Top 0.254: R13.2 95.57,61.91 99.69,66.04 99.69,66.99 J16.2
N$59
  Top 0.254: R14.2 97.79,48.26 102.87,48.26 J17.2
OUT1
  Top 0.508: REL1.C2 89.85,28.26 85.41,28.26 D1.A LED1.C 77.79,38.99 35,38.99 31.43,42.56 IC1.16
OUT2
  Top 0.508: REL2.C2 77.15,28.26 72.71,28.26 D2.A 72.39,28.51 LED2.C 66.62,37.21 34.21,37.21 30.43,41 28.32,41 28.02,41.3 IC1.15
OUT3
  Top 0.508: REL3.C2 64.45,28.26 60.01,28.26 D3.A 59.94,28.51 LED3.C 55.54,35.84 33.55,35.84 29.57,39.83 27.3,39.83 26.75,40.39 IC1.14
OUT4
  Top 0.508: 47.31,28.57 47.31,31.43 LED4.C 44.37,34.31 33.02,34.31 28.78,38.56 26.36,38.56 25.48,39.45 IC1.13 | 47.31,28.57 51.12,28.57 51.75,27.94 REL4.C2 | 47.31,28.57 D4.A
OUT5
  Top 0.508: 24.45,42.55 IC1.12 24.21,38.81 25.98,37.03 27.84,37.03 33.18,31.7 LED5.C 34.54,28.51 D5.A 34.61,28.26 39.05,28.26 REL5.C2
OUT6
  Top 0.508: REL6.C2 26.35,28.26 21.91,28.26 D6.A 21.91,28.57 21.91,31.43 LED6.C 21.87,31.47 21.87,33.63 22.93,34.7 IC1.11
OUT7
  Top 0.508: 21.59,42.55 IC1.10 21.67,39.83 16.13,34.29 10.79,34.29 8.89,32.38 8.89,31.43 LED7.C 8.89,31.11 8.89,28.57 D7.A 9.21,28.26 13.65,28.26 REL7.C2
RELAY1
  Top 0.254: IC1.1 29.53,48.26 47.83,48.26 49.94,50.37 49.94,53.24 47.61,55.56 45.09,55.56 NRF1.P0.0
RELAY2
  Top 0.254: 47.5,49.58 48.67,50.75 48.67,52.73 47.71,53.69 NRF1.P0.2 47.68,53.69 48.62,52.76 48.62,50.75 47.45,49.58 28.55,49.58 28.04,49.07 28.04,48.01 IC1.2 28.12,48.09
RELAY3
  Top 0.254: IC1.3 26.75,49.25 28.02,50.52 43.93,50.52 NRF1.P0.4
RELAY4
  Top 0.254: 25.72,48.26 IC1.4 | NRF1.P0.3 42.86,51.44 27.43,51.44 25.53,49.53 25.53,48.04 IC1.4 | 25.43,48.04 IC1.4
RELAY5
  Top 0.254: 24.45,48.26 IC1.5 24.26,48.04 24.26,49.53 27.3,52.58 40.74,52.58 41.82,53.66 42.86,53.66 NRF1.P0.1
RELAY6
  Top 0.254: IC1.6 22.93,49.86 27.25,54.18 39.9,54.18 41.41,55.69 NRF1.P0.30
RELAY7  (via drill 0.6 pad 1.02)
  Top 0.254: v21.7,51.9 21.7,48.02 IC1.7
  Bottom 0.254: NRF1.P0.28 41.69,59.69 37.9,55.9 25.4,55.9 v21.7,51.9
RXI
  Bottom 0.254: NRF1.P0.5 63.1,51.55 67.06,47.6 72.11,47.6 73.15,46.56 J3.2
SENS1  (via drill 0.6)
  Top 0.254: v15.24,61.72 R8.1
  Bottom 0.254: NRF1.P0.26 40.61,61.69 36.58,57.66 19.3,57.66 v15.24,61.72
SENS2  (via drill 0.6)
  Top 0.254: v22.86,61.98 R9.1
  Bottom 0.254: NRF1.P0.24 39.56,63.69 35.56,59.69 25.15,59.69 v22.86,61.98
SENS3  (via drill 0.6)
  Top 0.254: v34.29,61.98 R10.1
  Bottom 0.254: NRF1.P0.22 38,65.69 v34.29,61.98
SENS4
  Top 0.254: R14.1 97.47,50.16 97.47,52.7 95.57,54.61 86.04,54.61 85.09,55.56 81.92,55.56 81.28,54.93 65.41,54.93 65.09,55.24 65.09,55.56 NRF1.P0.10
SENS5
  Top 0.254: R11.1 74.61,61.91 65.41,61.91 NRF1.P0.16
SENS6
  Top 0.254: R12.1 86.36,61.59 78.11,61.59 75.56,59.05 65.41,59.05 65.09,59.37 65.09,59.69 NRF1.P0.14
SENS7
  Top 0.254: R13.1 93.34,61.59 90.17,61.59 88.9,60.33 78.42,60.33 75.56,57.47 65.41,57.47 NRF1.P0.12
SWCLK
  Bottom 0.254: J2.2 82.8,58.67 82.27,59.21 69.58,59.21 NRF1.SWCLK
SWDIO
  Top 0.254: 84.77,51.75 87.63,51.75 S1.1 | 84.77,51.75 84.14,51.75 R15.1 | 84.77,51.75 82.23,49.21 62.23,49.21 60.64,50.8 60.64,61.28 62.87,63.5 NRF1.SWDIO
  Bottom 0.254: J2.4 87.95,57.15 87.95,52.07 S1.1
TXO
  Bottom 0.254: 75.56,46.04 75.56,45.4 J3.3 75.56,45.34 75.56,47.32 73.99,48.9 67.94,48.9 65.41,51.44 NRF1.P0.6
VCC
  Top 0.61: J1.VBUS 13.75,45.5 13.97,45.72 14.73,45.72 15.24,46.23
  pour Top (isolate 0.61): 0,53.34 33.02,53.34 33.02,41.91 106.68,41.91 106.68,22.86 0,22.86
VDD
  pour Top (isolate 0.61): 0,71.12 106.68,71.12 106.68,43.18 34.29,43.18 34.29,54.61 0,54.61